# EAGLE design SpondeV2 (EAGLE 9.6.2)
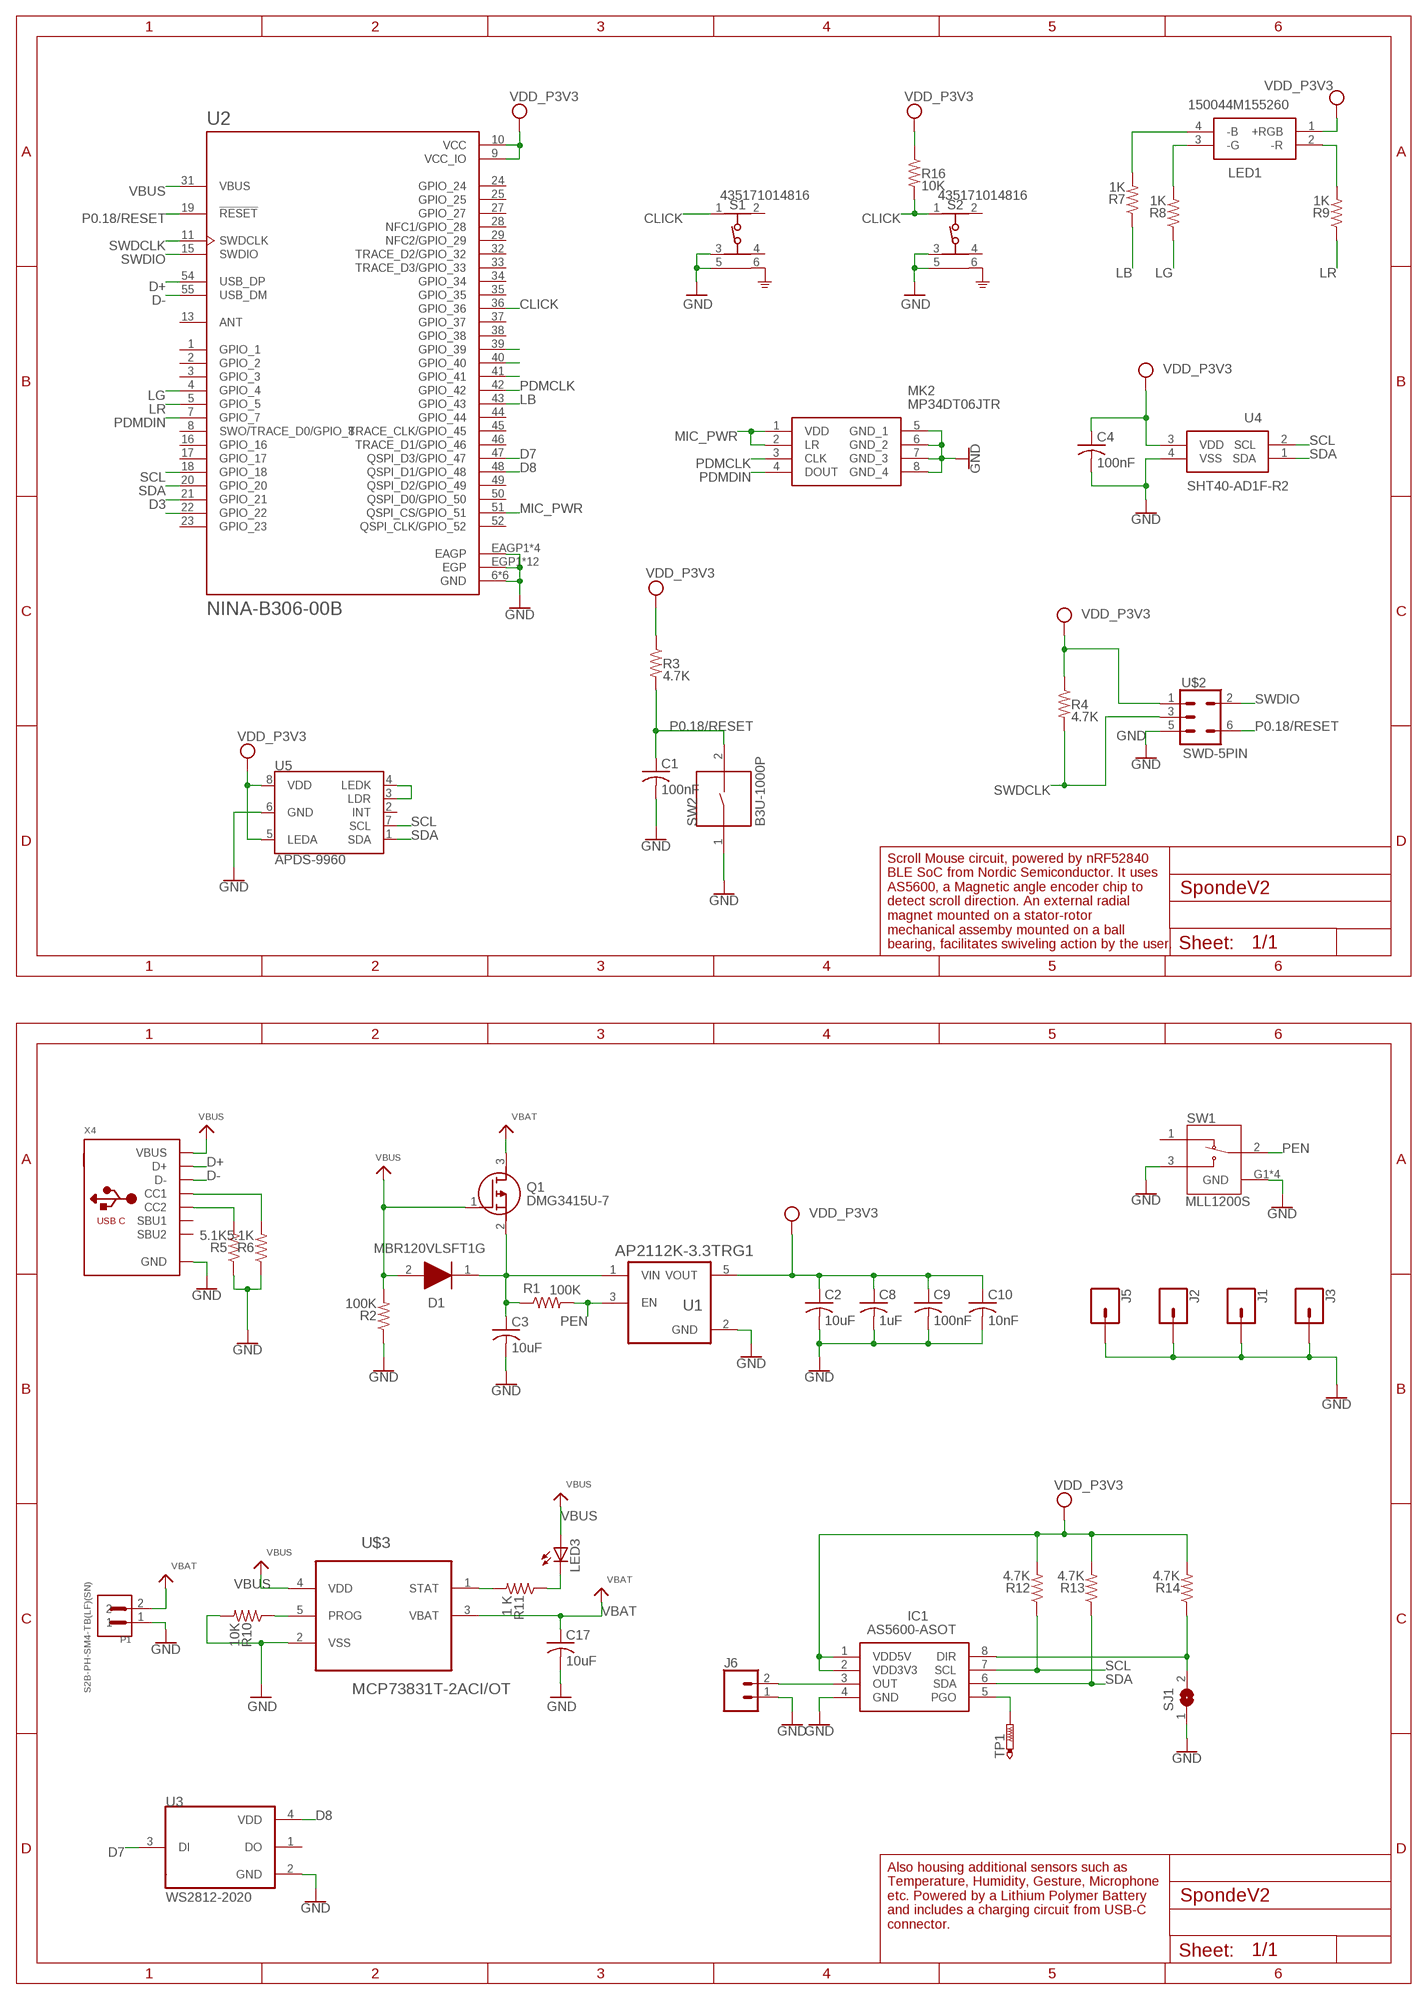
[diagram p0: schematic, sheet 1]

## Parts
C1  100nF  C-USC0402  [C0402]
C2  10uF  C-USC0402  [C0402]
C3  10uF  C-USC0402  [C0402]
C4  100nF  C-USC0402  [C0402]
C8  1uF  C-USC0402  [C0402]
C9  100nF  C-USC0402  [C0402]
C10  10nF  C-USC0402  [C0402]
C17  10uF  C-USC0402  [C0402]
D1  MBR120VLSFT1G  [SODFL3616X98N]
IC1  AS5600-ASOT  [SOIC127P600X175-8N]
J1  CONN_01PTH_2MM  [1X01_2MM]
J2  CONN_01PTH_2MM  [1X01_2MM]
J3  CONN_01PTH_2MM  [1X01_2MM]
J5  CONN_01PTH_2MM  [1X01_2MM]
J6  CONN_02LOCK_LONGPADS  [1X02_LOCK_LONGPADS]
LED1  150044M155260  [150044M155260]
LED3  LEDCHIPLED_0603  [CHIPLED_0603]
MK2  MP34DT06JTR  [MP34DT06JTR]
P1  S2B-PH-SM4-TB(LF)(SN)  [JST_S2B-PH-SM4-TB(LF)(SN)]
Q1  DMG3415U-7  [SOT96P240X100-3N]
R1  100K  R-US_R0402  [R0402]
R2  100K  R-US_R0402  [R0402]
R3  4.7K  R-US_R0402  [R0402]
R4  4.7K  R-US_R0402  [R0402]
R5  5.1K  R-US_R0402  [R0402]
R6  5.1K  R-US_R0402  [R0402]
R7  1K  R-US_R0402  [R0402]
R8  1K  R-US_R0402  [R0402]
R9  1K  R-US_R0402  [R0402]
R10  10K  R-US_R0402  [R0402]
R11  1 K  R-US_R0402  [R0402]
R12  4.7K  R-US_R0402  [R0402]
R13  4.7K  R-US_R0402  [R0402]
R14  4.7K  R-US_R0402  [R0402]
R16  10K  R-US_R0402  [R0402]
S1  435171014816  [435171014816]
S2  435171014816  [435171014816]
SJ1  SJ  [SJ]
SW1  MLL1200S  [SW_MLL1200S]
SW2  B3U-1000P  [SW_B3U-1000P]
TP1  PTR1B2,54  [B2,54]
U1  AP2112K-3.3TRG1  [SOT95P285X140-5N]
U2  NINA-B306-00B  [XCVR_NINA-B306-00B]
U3  WS2812-2020  [LED_WS2812-2020]
U4  SHT40-AD1F-R2  [SHT40AD1FR2]
U5  APDS-9960  [APDS-9960]
U$2  SWD-5PIN  [PAD_05_03X2_TP_NO4]
U$3  MCP73831T-2ACI/OT  [SOT95P280X145-5N]
X4  MICROBUILDER_USB_C  [MICROBUILDER_USB_C_CUSB31-CFM2AX-01-X]

## Nets
CLICK: R16.2 S1.1 S2.1 U2.36(GPIO_36)
D3: U2.21(GPIO_21)
D7: U2.47(QSPI_D3/GPIO_47) U3.3(DI)
D8: U2.48(QSPI_D1/GPIO_48) U3.4(VDD)
D+: U2.54(USB_DP) X4.A6(D+) X4.B6(D+)
D-: U2.55(USB_DM) X4.A7(D-) X4.B7(D-)
GND: C1.2 C2.2 C3.2 C4.2 C8.2 C9.2 C10.2 C17.2 IC1.4(GND) J1.1 J2.1 J3.1 J5.1 J6.1 MK2.5(GND_1) MK2.6(GND_2) MK2.7(GND_3) MK2.8(GND_4) P1.1 R2.1 R5.1 R6.1 R10.2 S1.3 S1.5 S2.3 S2.5 SJ1.1 SW1.3 SW1.G1(GND) SW1.G2(GND) SW1.G3(GND) SW1.G4(GND) SW2.1 U1.2(GND) U2.6(GND) U2.12(GND) U2.14(GND) U2.26(GND) U2.30(GND) U2.53(GND) U2.EAGP1(EAGP) U2.EAGP2(EAGP) U2.EAGP3(EAGP) U2.EAGP4(EAGP) U2.EGP1(EGP) U2.EGP2(EGP) U2.EGP3(EGP) U2.EGP4(EGP) U2.EGP5(EGP) U2.EGP6(EGP) U2.EGP7(EGP) U2.EGP8(EGP) U2.EGP9(EGP) U2.EGP10(EGP) U2.EGP11(EGP) U2.EGP12(EGP) U3.2(GND) U4.4(VSS) U5.6(GND) U$2.5 U$3.2(VSS) X4.A1B12(GND) X4.B1A12(GND)
LB: R7.1 U2.43(GPIO_43)
LG: R8.1 U2.4(GPIO_4)
LR: R9.1 U2.5(GPIO_5)
MIC_PWR: MK2.1(VDD) MK2.2(LR) U2.51(QSPI_CS/GPIO_51)
N$1: U2.22(GPIO_22)
N$2: IC1.5(PGO) TP1.TP
N$3: U2.41(GPIO_41)
N$4: R11.2 U$3.1(STAT)
N$5: U2.40(GPIO_40)
N$6: U2.39(GPIO_39)
N$7: R5.2 X4.B5(CC2)
N$9: R6.2 X4.A5(CC1)
N$10: C3.1 D1.1(K) Q1.2(S) R1.1 U1.1(VIN)
N$12: U5.3(LDR) U5.4(LEDK)
N$13: IC1.8(DIR) R14.1 SJ1.2
N$15: IC1.3(OUT) J6.2
N$17: LED1.4(-B) R7.2
N$18: LED1.3(-G) R8.2
N$26: R10.1 U$3.5(PROG)
N$30: LED3.C R11.1
N$32: LED1.2(-R) R9.2
P0.18/RESET: C1.1 R3.2 SW2.2 U2.19(!RESET) U$2.6
PDMCLK: MK2.3(CLK) U2.42(GPIO_42)
PDMDIN: MK2.4(DOUT) U2.7(GPIO_7)
PEN: R1.2 SW1.2 U1.3(EN)
SCL: IC1.7(SCL) R12.1 U2.18(GPIO_18) U4.2(SCL) U5.7(SCL)
SDA: IC1.6(SDA) R13.1 U2.20(GPIO_20) U4.1(SDA) U5.1(SDA)
SWDCLK: R4.2 U2.11(SWDCLK) U$2.3
SWDIO: U2.15(SWDIO) U$2.2
VBAT: C17.1 P1.2 Q1.3(D) U$3.3(VBAT)
VBUS: D1.2(A) LED3.A Q1.1(G) R2.2 U2.31(VBUS) U$3.4(VDD) X4.A4B9(VBUS) X4.B4A9(VBUS)
VCC: C2.1 C4.1 C8.1 C9.1 C10.1 IC1.1(VDD5V) IC1.2(VDD3V3) LED1.1(+RGB) R3.1 R4.1 R12.2 R13.2 R14.2 R16.1 U1.5(VOUT) U2.9(VCC_IO) U2.10(VCC) U4.3(VDD) U5.5(LEDA) U5.8(VDD) U$2.1 ; supply symbol labelled VDD_P3V3
Unconnected: S1.2 S1.4 S1.6 S2.2 S2.4 S2.6 SW1.1 U2.1(GPIO_1) U2.2(GPIO_2) U2.3(GPIO_3) U2.8(SWO/TRACE_D0/GPIO_8) U2.13(ANT) U2.16(GPIO_16) U2.17(GPIO_17) U2.23(GPIO_23) U2.24(GPIO_24) U2.25(GPIO_25) U2.27(GPIO_27) U2.28(NFC1/GPIO_28) U2.29(NFC2/GPIO_29) U2.32(TRACE_D2/GPIO_32) U2.33(TRACE_D3/GPIO_33) U2.34(GPIO_34) U2.35(GPIO_35) U2.37(GPIO_37) U2.38(GPIO_38) U2.44(GPIO_44) U2.45(TRACE_CLK/GPIO_45) U2.46(TRACE_D1/GPIO_46) U2.49(QSPI_D2/GPIO_49) U2.50(QSPI_D0/GPIO_50) U2.52(QSPI_CLK/GPIO_52) U3.1(DO) U5.2(INT) X4.A8(SBU1) X4.B8(SBU2)

## Notes on the sheet
- Scroll Mouse circuit, powered by nRF52840 
  BLE SoC from Nordic Semiconductor. It uses 
  AS5600, a Magnetic angle encoder chip to 
  detect scroll direction. An external radial
  magnet mounted on a stator-rotor 
  mechanical assemby mounted on a ball 
  bearing, facilitates swiveling action by the user.
- Also housing additional sensors such as 
  Temperature, Humidity, Gesture, Microphone 
  etc. Powered by a Lithium Polymer Battery
  and includes a charging circuit from USB-C
  connector.

## Library data of the parts
C1-C4 C8-C10 C17 = adafruit:C-US: CAPACITOR, American symbol
D1 = MBR120VLSFT1G:MBR120VLSFT1G: Diode Schottky 20V 1A SOD123FL ON Semi MBR120VLSFT1G, SMT Schottky Diode, 20V 1A, 2-Pin SOD-123FL Source: Datasheet <http://www.onsemi.com/pub/Collateral/MBR120VLSFT1-D.PDF>; DESCRIPTION: Diode Schottky 20V 1A SOD123FL ON Semi MBR120VLSFT1G, SMT Schottky Diode, 20V 1A, 2-Pin SOD-123FL; HEIGHT: 0.98mm; MANUFACTURER_NAME: ON Semiconductor; MANUFACTURER_PART_NUMBER: MBR120VLSFT1G; MOUSER_PART_NUMBER: 863-MBR120VLSFT1G; MOUSER_PRICE-STOCK: https://www.mouser.co.uk/ProductDetail/ON-Semiconductor/MBR120VLSFT1G?qs=3JMERSakebpX%252BkItPpFCkg%3D%3D
IC1 = AS5600-ASOT:AS5600-ASOT: Board Mount Hall Effect / Magnetic Sensors AS5600 Magnetic Sensor 12-Bit Source: Datasheet <https://datasheet.datasheetarchive.com/originals/distributors/DKDS-11/214624.pdf>; ARROW_PART_NUMBER: AS5600-ASOT; ARROW_PRICE-STOCK: https://www.arrow.com/en/products/as5600-asot/ams-osram?utm_currency=USD&region=nac; DESCRIPTION: Board Mount Hall Effect / Magnetic Sensors AS5600 Magnetic Sensor 12-Bit; HEIGHT: 1.75mm; MANUFACTURER_NAME: ams OSRAM; MANUFACTURER_PART_NUMBER: AS5600-ASOT; MOUSER_PART_NUMBER: 985-AS5600-ASOT; MOUSER_PRICE-STOCK: https://www.mouser.co.uk/ProductDetail/ams-OSRAM/AS5600-ASOT?qs=KTMMzrZdriGJpjhsnAEYBA%3D%3D
J1-J3 J5 = SparkFun-Connectors:CONN_01: Single connection point. Often used as Generic Header-pin footprint for 0.1 inch spaced/style header connections On any of the 0.1 inch spaced packages, you can populate with these: Break Away Headers - Straight <https://www.sparkfun.com/products/116> (PRT-00116) Break Away Male Headers - Right Angle <https://www.sparkfun.com/products/553> (PRT-00553) Female Headers <https://www.sparkfun.com/products/115> (PRT-00115) Break Away Headers - Machine Pin <https://www.sparkfun.com/products/117> (PRT-00117) Break Away Female Headers - Swiss Machine Pin <https://www.sparkfun.com/products/743> (PRT-00743) This device is also useful as a general connection point to wire up your design to another part of your project. Our various solder wires solder well into these plated through hole pads. Hook-Up Wire - Assortment (Stranded, 22 AWG) <https://www.sparkfun.com/products/11375> (PRT-11375) Hook-Up Wire - Assortment (Solid Core, 22 AWG) <https://www.sparkfun.com/products/11367> (PRT-11367) View the entire wire category on our website here <https://www.sparkfun.com/categories/141> Special notes: SMTSO-256-ET is a "flush mount" nut for a 4-40 screw. We mostly use this on specialty testbeds; it is a nice way to connect hardware to your PCB at an adjustable hieght. Also note, the SNAP packages are for using a snappable style connector. We sell a baggie of snaps and they are also used on two LilyPad designs: Snap Assortment - 30 pack (male and female) <https://www.sparkfun.com/products/11347> (DEV-11347) LilyPad Arduino SimpleSnap <https://www.sparkfun.com/products/10941> (DEV-10941) LilyPad SimpleSnap Protoboard <https://www.sparkfun.com/products/10940> (DEV-10940)
J6 = SparkFun-Connectors:CONN_02: Multi connection point. Often used as Generic Header-pin footprint for 0.1 inch spaced/style header connections On any of the 0.1 inch spaced packages, you can populate with these: Break Away Headers - Straight <https://www.sparkfun.com/products/116> (PRT-00116) Break Away Male Headers - Right Angle <https://www.sparkfun.com/products/553> (PRT-00553) Female Headers <https://www.sparkfun.com/products/115> (PRT-00115) Break Away Headers - Machine Pin <https://www.sparkfun.com/products/117> (PRT-00117) Break Away Female Headers - Swiss Machine Pin <https://www.sparkfun.com/products/743> (PRT-00743) For SCREWTERMINALS and SPRING TERMINALS visit here: Screw Terimnals on SparkFun.com <https://www.sparkfun.com/search/results?term=Screw+Terminals> (5mm/3.5mm/2.54mm spacing) This device is also useful as a general connection point to wire up your design to another part of your project. Our various solder wires solder well into these plated through hole pads. Hook-Up Wire - Assortment (Stranded, 22 AWG) <https://www.sparkfun.com/products/11375> (PRT-11375) Hook-Up Wire - Assortment (Solid Core, 22 AWG) <https://www.sparkfun.com/products/11367> (PRT-11367) View the entire wire category on our website here <https://www.sparkfun.com/categories/141> Special notes: Molex polarized connector foot print use with: PRT-08233 with associated crimp pins and housings. 2.54_SCREWTERM for use with PRT-10571. 3.5mm Screw Terminal footprints for PRT-08084 5mm Screw Terminal footprints for use with PRT-08432
LED1 = Wurth-RGB-150044M155260:150044M155260: 2.4 V, 3.1 V, 3.3 V RGB LED 1010 (0404) SMD, Wurth Elektronik WL-SFCC 150044M155260 Source: Datasheet <https://www.we-online.com/catalog/datasheet/150044M155260.pdf>; DESCRIPTION: 2.4 V, 3.1 V, 3.3 V RGB LED 1010 (0404) SMD, Wurth Elektronik WL-SFCC 150044M155260; HEIGHT: 0.75mm; MANUFACTURER_NAME: Wurth Elektronik; MANUFACTURER_PART_NUMBER: 150044M155260; MOUSER_PART_NUMBER: 710-150044M155260; MOUSER_PRICE-STOCK: https://www.mouser.co.uk/ProductDetail/Wurth-Elektronik/150044M155260?qs=u16ybLDytRba39Og9E2ywA%3D%3D
LED3 = adafruit:LED: LED OSRAM: - CHIPLED LG R971, LG N971, LY N971, LG Q971, LY Q971, LO R971, LY R971 LH N974, LH R974 LS Q976, LO Q976, LY Q976 LO Q996 - Hyper CHIPLED LW Q18S LB Q993, LB Q99A, LB R99A - SideLED LS A670, LO A670, LY A670, LG A670, LP A670 LB A673, LV A673, LT A673, LW A673 LH A674 LY A675 LS A676, LA A676, LO A676, LY A676, LW A676 LS A679, LY A679, LG A679 - Hyper Micro SIDELED® LS Y876, LA Y876, LO Y876, LY Y876 LT Y87S - SmartLED LW L88C, LW L88S LB L89C, LB L89S, LG L890 LS L89K, LO L89K, LY L89K LS L896, LA L896, LO L896, LY L896 - TOPLED LS T670, LO T670, LY T670, LG T670, LP T670 LSG T670, LSP T670, LSY T670, LOP T670, LYG T670 LG T671, LOG T671, LSG T671 LB T673, LV T673, LT T673, LW T673 LH T674 LS T676, LA T676, LO T676, LY T676, LB T676, LH T676, LSB T676, LW T676 LB T67C, LV T67C, LT T67C, LS T67K, LO T67K, LY T67K, LW E67C LS E67B, LA E67B, LO E67B, LY E67B, LB E67C, LV E67C, LT E67C LW T67C LS T679, LY T679, LG T679 LS T770, LO T770, LY T770, LG T770, LP T770 LB T773, LV T773, LT T773, LW T773 LH T774 LS E675, LA E675, LY E675, LS T675 LS T776, LA T776, LO T776, LY T776, LB T776 LHGB T686 LT T68C, LB T68C - Hyper Mini TOPLED® LB M676 - Mini TOPLED Santana® LG M470 LS M47K, LO M47K, LY M47K Source: http://www.osram.convergy.de/
MK2 = MP34DT06JTR:MP34DT06JTR: 100 Hz ~ 10 kHz Digital, PDM Microphone MEMS (Silicon) Omnidirectional (-26dB +/-3dB @ 94dB SPL) Solder Pads Source: Datasheet <https://www.st.com/resource/en/datasheet/mp34dt06j.pdf>; ARROW_PART_NUMBER: MP34DT06JTR; ARROW_PRICE-STOCK: https://www.arrow.com/en/products/mp34dt06jtr/stmicroelectronics?region=nac; DESCRIPTION: 100 Hz ~ 10 kHz Digital, PDM Microphone MEMS (Silicon) Omnidirectional (-26dB +/-3dB @ 94dB SPL) Solder Pads; HEIGHT: 1.1mm; MANUFACTURER_NAME: STMicroelectronics; MANUFACTURER_PART_NUMBER: MP34DT06JTR; MOUSER_PART_NUMBER: 511-MP34DT06JTR; MOUSER_PRICE-STOCK: https://www.mouser.co.uk/ProductDetail/STMicroelectronics/MP34DT06JTR?qs=%252BEew9%252B0nqrDi3H2kv8Y1Xg%3D%3D
P1 = S2B-PH-SM4-TB_LF__SN_:S2B-PH-SM4-TB(LF)(SN): CONN HEADER PH SIDE 2POS 2MM SMD; AVAILABILITY: Unavailable; DESCRIPTION: Connector Header Surface Mount, Right Angle 2 position 0.079 _2.00mm_; MF: JST Sales; MP: S2B-PH-SM4-TB _LF__SN_; PACKAGE: None; PRICE: None
Q1 = DMG3415U-7:DMG3415U-7: P-CHANNEL ENHANCEMENT MODE MOSFET Source: Datasheet <https://datasheet.lcsc.com/szlcsc/Diodes-Incorporated-DMG3415U-7_C96616.pdf>; DESCRIPTION: P-CHANNEL ENHANCEMENT MODE MOSFET; HEIGHT: 1mm; LCSC_PART_NUMBER: C96616; LCSC_PRICE-STOCK: https://lcsc.com/product-detail/MOSFET_Diodes-Incorporated_DMG3415U-7_Diodes-Incorporated-DMG3415U-7_C96616.html; MANUFACTURER_NAME: Diodes Inc.; MANUFACTURER_PART_NUMBER: DMG3415U-7
R1-R14 R16 = adafruit:R-US_: RESISTOR, American symbol
S1 S2 = 435171014816:435171014816: Check availability <https://pricing.snapeda.com/parts/435171014816/W%C3%BCrth%20Elektronik/view-part?ref=eda>; AVAILABILITY: In Stock; CHECK_PRICES: https://www.snapeda.com/parts/435171014816/W%25C3%25BCrth+Elektronik+Midcom/view-part/?ref=eda; DESCRIPTION: Tactile Switch SPST-NO Top Actuated Surface Mount; MF: Würth Elektronik; MP: 435171014816; PACKAGE: None; PRICE: None; SNAPEDA_LINK: https://www.snapeda.com/parts/435171014816/W%25C3%25BCrth+Elektronik+Midcom/view-part/?ref=snap
SJ1 = jumper:SJ: SMD solder JUMPER
SW1 = MLL1200S:MLL1200S: Switch Slide SPDT Side Slide 0.3A 4VDC Gull Wing SMD Box Check prices <https://pricing.snapeda.com/parts/MLL1200S/TE%20Connectivity/view-part?ref=eda>; AVAILABILITY: In Stock; COMMENT: 1437575-1; DESCRIPTION: Slide Switch SPDT Surface Mount, Right Angle; MF: TE Connectivity; MP: MLL1200S; PACKAGE: None; PRICE: None; PURCHASE-URL: https://pricing.snapeda.com/search/part/MLL1200S/?ref=eda
SW2 = B3U-1000P:B3U-1000P: Switch Tactile N.O. SPST Round Button Gull Wing 0.05A 12VDC 1.5N SMD Embossed T/R; AVAILABILITY: Unavailable; DESCRIPTION: Switch Tactile N.O. SPST Round Button Gull Wing 0.05A 12VDC 1.5N SMD Embossed T/R; MF: Omron; MP: B3U-1000P; PACKAGE: None; PRICE: None
TP1 = testpad:PTR1: TEST PIN
U1 = AP2112K-3.3TRG1:AP2112K-3.3TRG1: AP2112 Series 0.6 A 3.3 V Fixed Output SMT LDO Linear Regulator - SOT23-5; AVAILABILITY: Unavailable; DESCRIPTION: AP2112 Series 0.6 A 3.3 V Fixed Output SMT LDO Linear Regulator - SOT23-5; MF: Diodes Inc.; MP: AP2112K-3.3TRG1; PACKAGE: SOT-753 Diodes Inc.; PRICE: None
U2 = NINA-B306-00B:NINA-B306-00B: With internal PCB antenna, 10.0 x 15.0 x 2.2 mm, use with open CPU Check availability <https://pricing.snapeda.com/parts/NINA-B306-00B/U-Blox/view-part?ref=eda>; AVAILABILITY: In Stock; CHECK_PRICES: https://www.snapeda.com/parts/NINA-B306-00B/u-blox/view-part/?ref=eda; DESCRIPTION: Bluetooth Bluetooth v5.0 Transceiver Module 2.4GHz Integrated, Trace Surface Mount; MF: U-Blox; MP: NINA-B306-00B; PACKAGE: SMD-55 U-Blox; PRICE: None; PURCHASE-URL: https://www.snapeda.com/api/url_track_click_mouser/?unipart_id=4800389&manufacturer=U-Blox&part_name=NINA-B306-00B&search_term=nina-b306-00b; SNAPEDA_LINK: https://www.snapeda.com/parts/NINA-B306-00B/u-blox/view-part/?ref=snap
U3 = WS2812-2020:WS2812-2020: Intelligent control LED integrated light source Check availability <https://pricing.snapeda.com/parts/WS2812-2020/Worldsemi/view-part?ref=eda>; AVAILABILITY: Not in stock; DESCRIPTION: Intelligent control LED light source, SMD-4; MF: Worldsemi; MP: WS2812-2020; PACKAGE: Package; PRICE: None
U4 = SHT40-AD1F-R2:SHT40-AD1F-R2: Board Mount Humidity Sensors Digital Humidity and Temperature Sensor incl Filter Membrane Source: Datasheet <https://sensirion.com/media/documents/33FD6951/63E1087C/Datasheet_SHT4x_1.pdf>; ARROW_PART_NUMBER: SHT40-AD1F-R2; ARROW_PRICE-STOCK: https://www.arrow.com/en/products/sht40-ad1f-r2/sensirion-ag?region=nac; DESCRIPTION: Board Mount Humidity Sensors Digital Humidity and Temperature Sensor incl Filter Membrane; HEIGHT: 0.59mm; MANUFACTURER_NAME: Sensirion; MANUFACTURER_PART_NUMBER: SHT40-AD1F-R2; MOUSER_PART_NUMBER: 403-SHT40-AD1F-R2; MOUSER_PRICE-STOCK: https://www.mouser.co.uk/ProductDetail/Sensirion/SHT40-AD1F-R2?qs=rQFj71Wb1eVPr6MxV5k7AQ%3D%3D
U5 = APDS-9960:APDS-9960: Avago APDS-9960 Digital Proximity, Ambient Light, RGB, and Gesture Sensor. The APDS-9960 offers ambient light and color measuring, proximity detection, and touchless gesture sensing. It features UV and IR blocking filters, four separate diodes sensitive to different directions, and an I2C compatible interface. Datasheet <https://cdn.sparkfun.com/datasheets/Sensors/Proximity/apds9960.pdf> SparkFun Products SparkFun RGB and Gesture Sensor - APDS-9960 <https://www.sparkfun.com/products/12787> (SEN-12787) Check availability <https://pricing.snapeda.com/parts/APDS-9960/Broadcom%20Limited/view-part?ref=eda>; AVAILABILITY: In Stock; DESCRIPTION: Optical Sensor Ambient 560nm I²C 8-SMD Module; MF: Broadcom Limited; MP: APDS-9960; PACKAGE: SMD-8 Broadcom Limited; PRICE: None; PURCHASE-URL: https://pricing.snapeda.com/search/part/APDS-9960/?ref=eda
U$2 = SparkFun-Connectors:SWD-5PIN: 5-pin SWD connector Test-point based header for SWD. Pin 1 - PWR Pin 2 - SWDIO Pin 3 - SWCLK Pin 4 - NC Pin 5 - GND Pin 6 - RESET
U$3 = MCP73831T-2ACI_OT:MCP73831T-2ACI/OT: Charge Management Controller; AVAILABILITY: Unavailable; DESCRIPTION: MCP73831 Series Single-Cell Li-Ion/Li-Polymer Battery Charge Controller SOT-23-5; MF: Microchip; MP: MCP73831T-2ACI/OT; PACKAGE: SOT-23 Microchip; PRICE: None
X4 = Adafruit Feather STM32F405 Express:MICROBUILDER_USB_C: USB Type-C USB 2.0 Connector

## Board
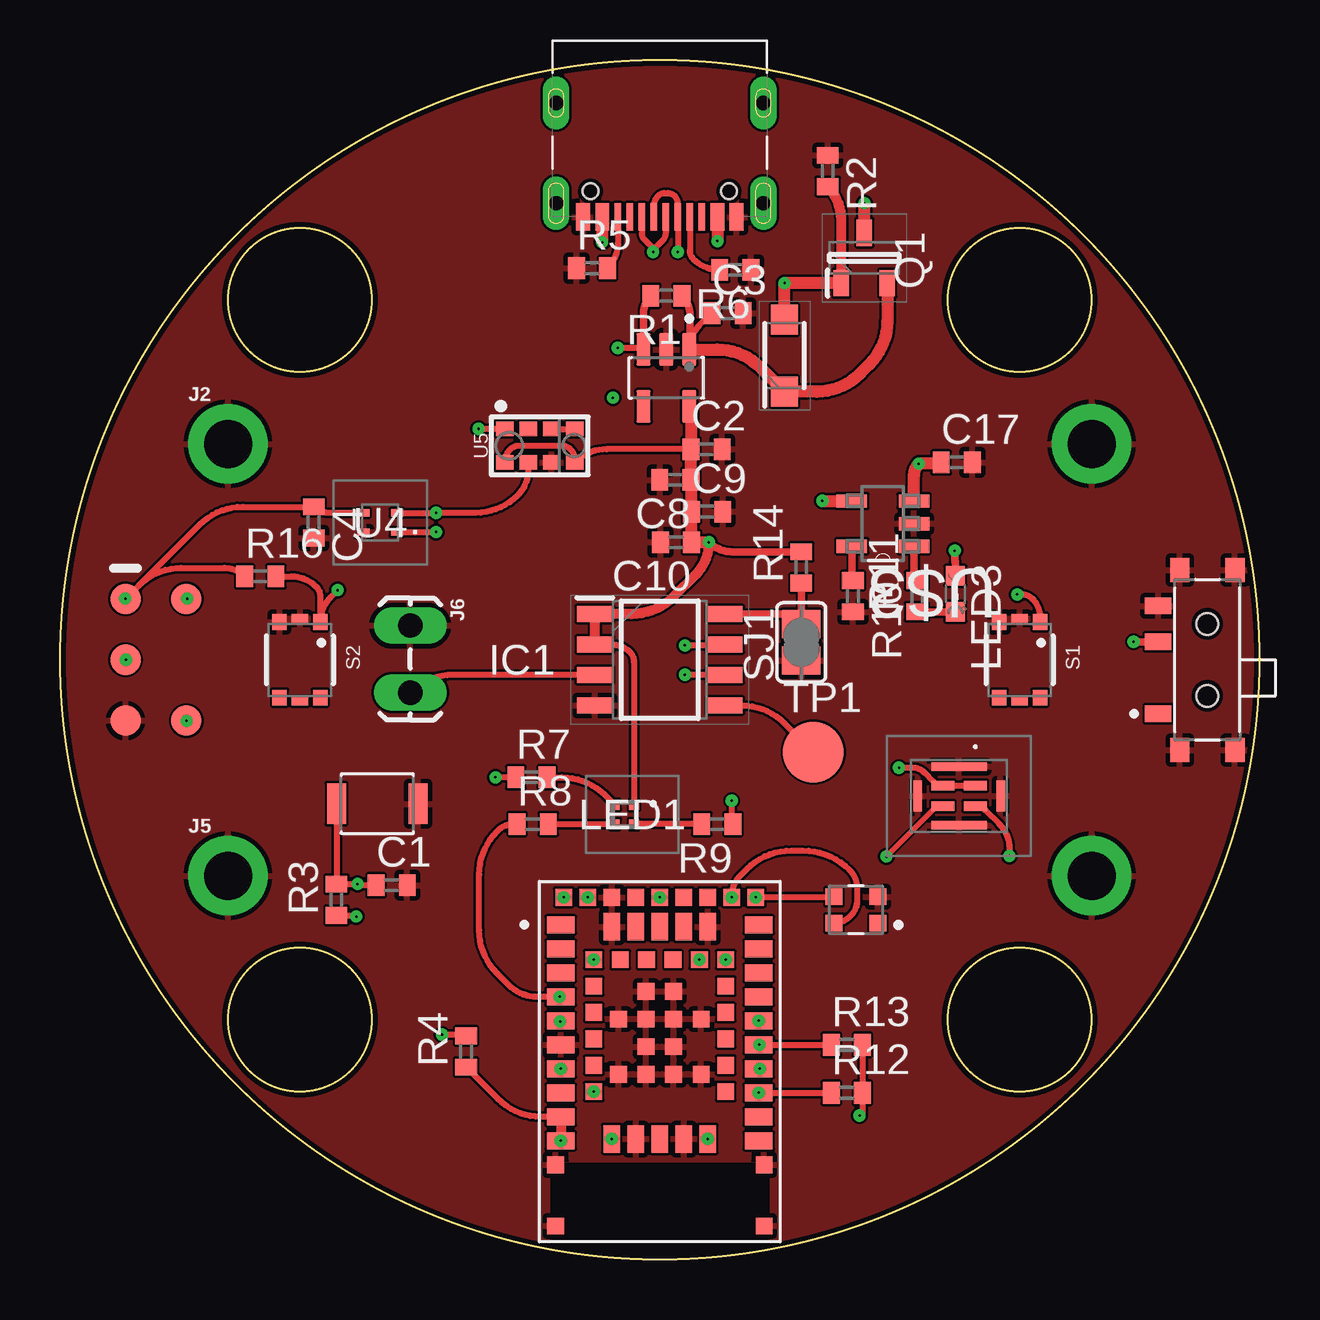
[diagram p1: board, top side]
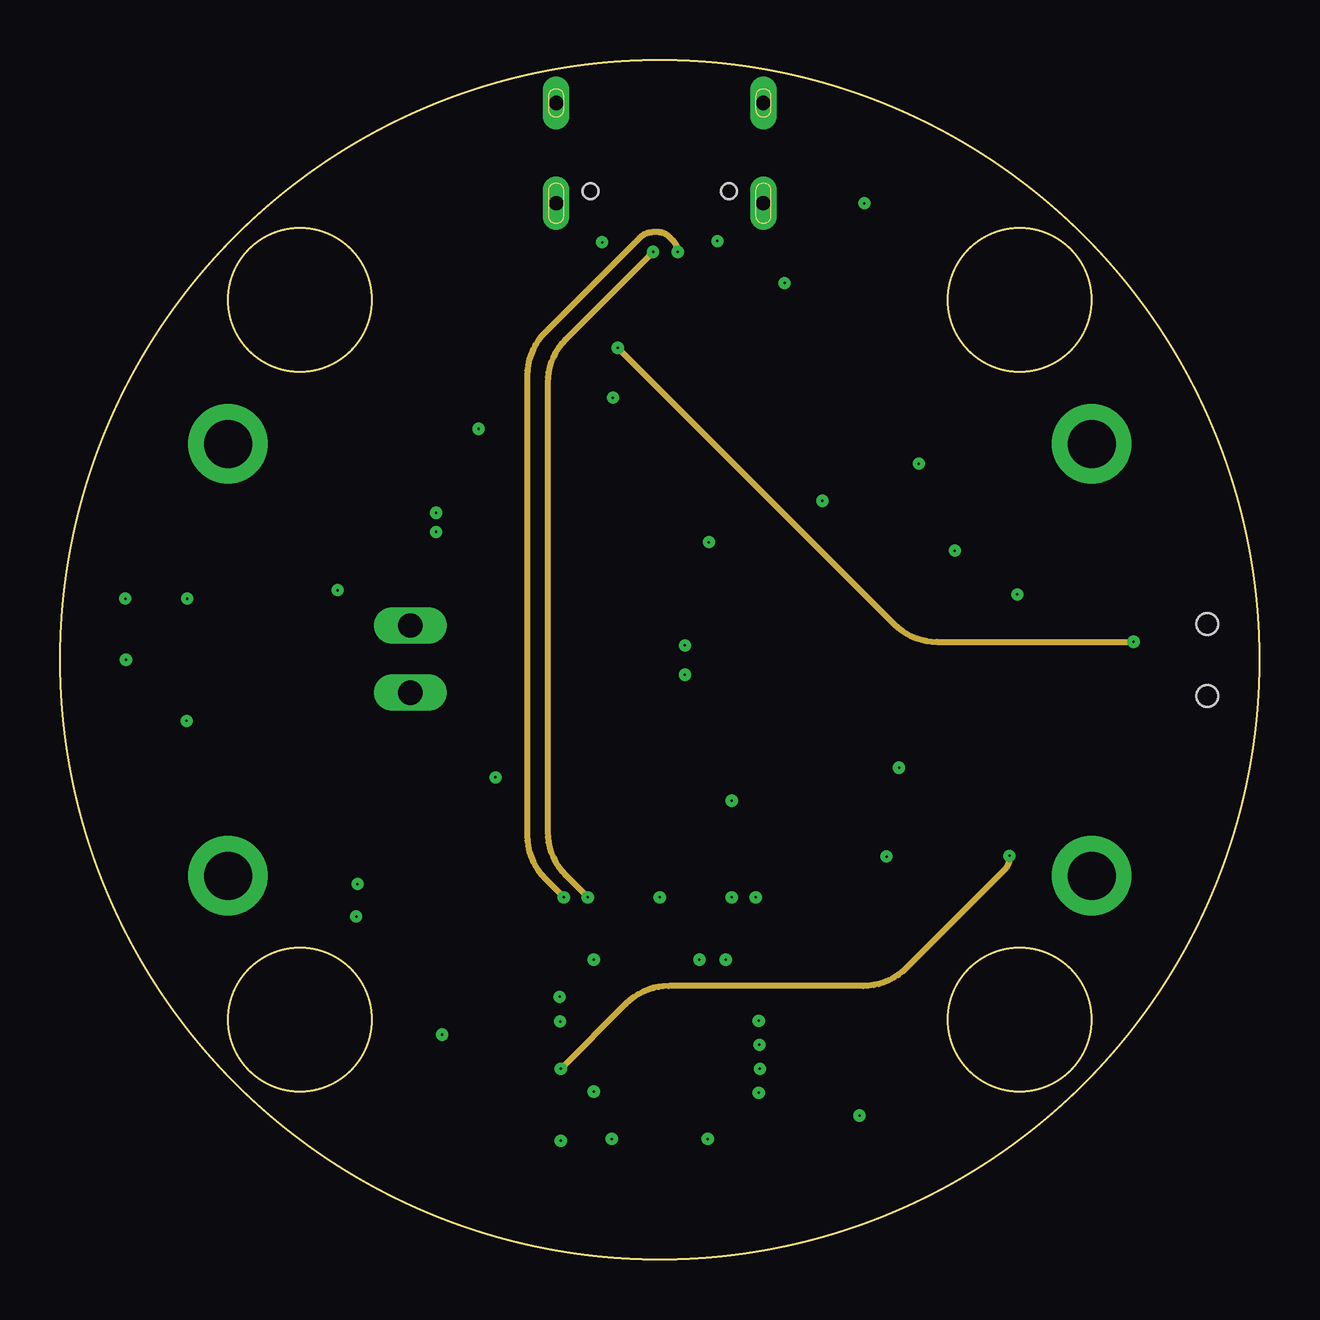
[diagram p2: board, inner layer Route2]
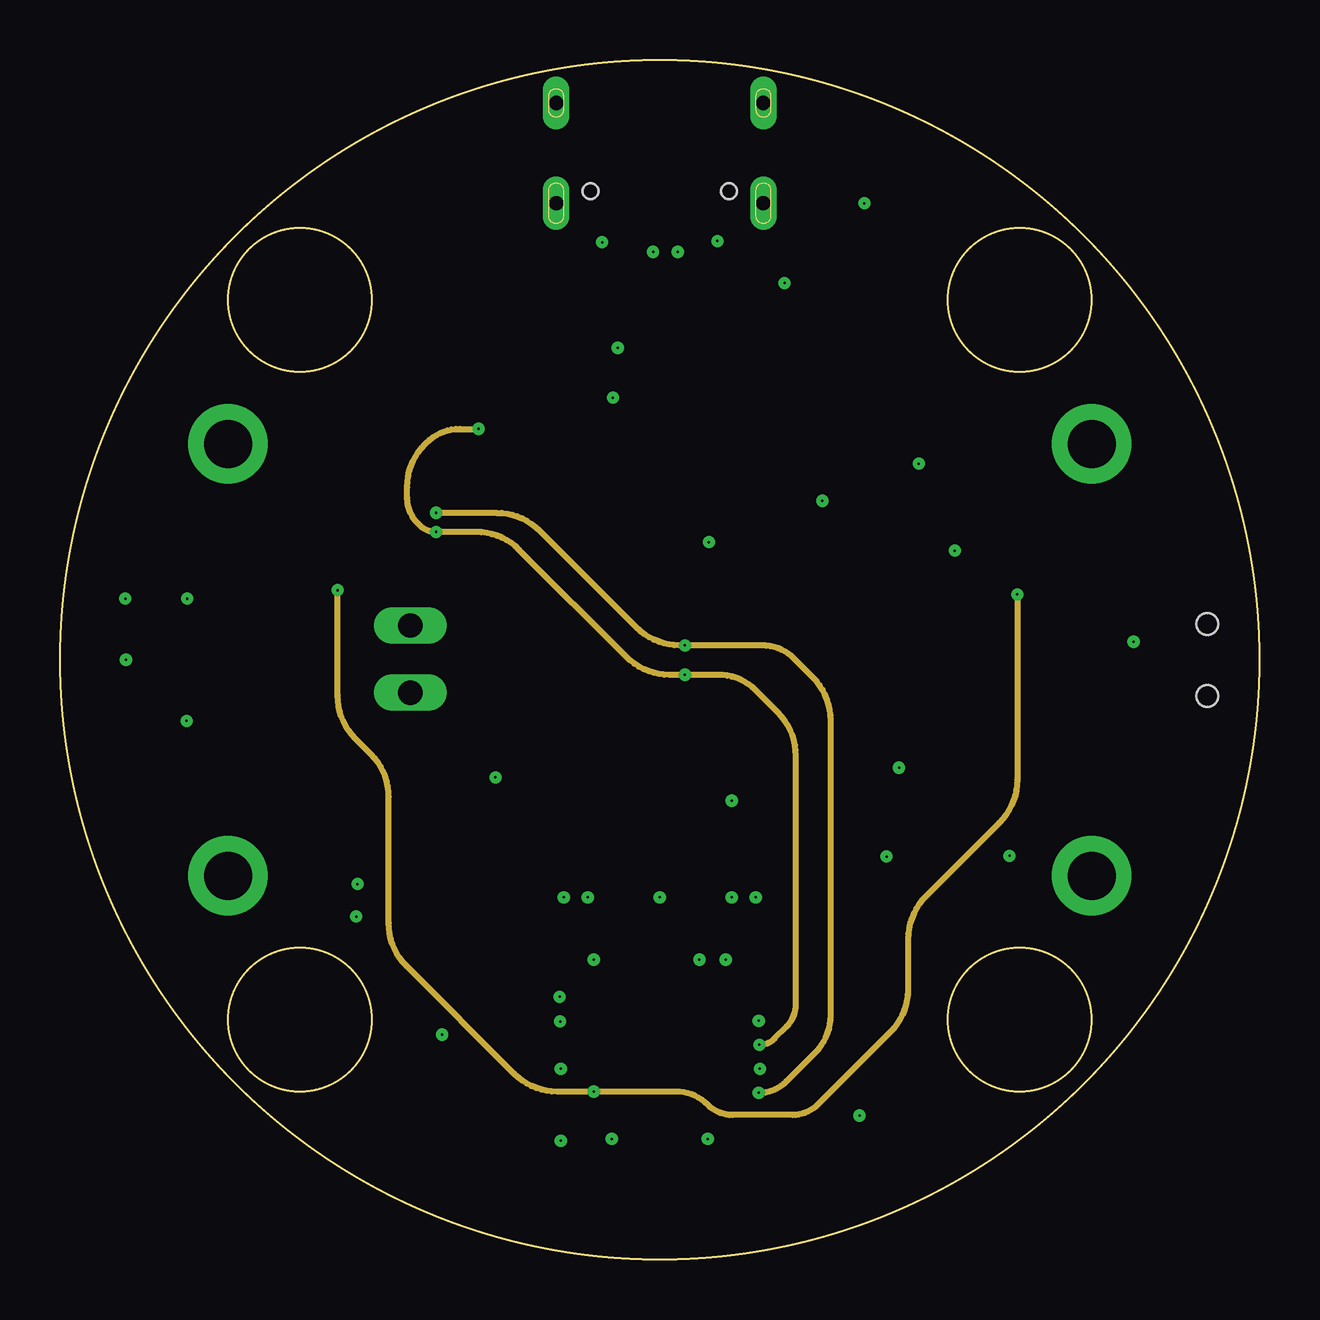
[diagram p3: board, inner layer Route3]
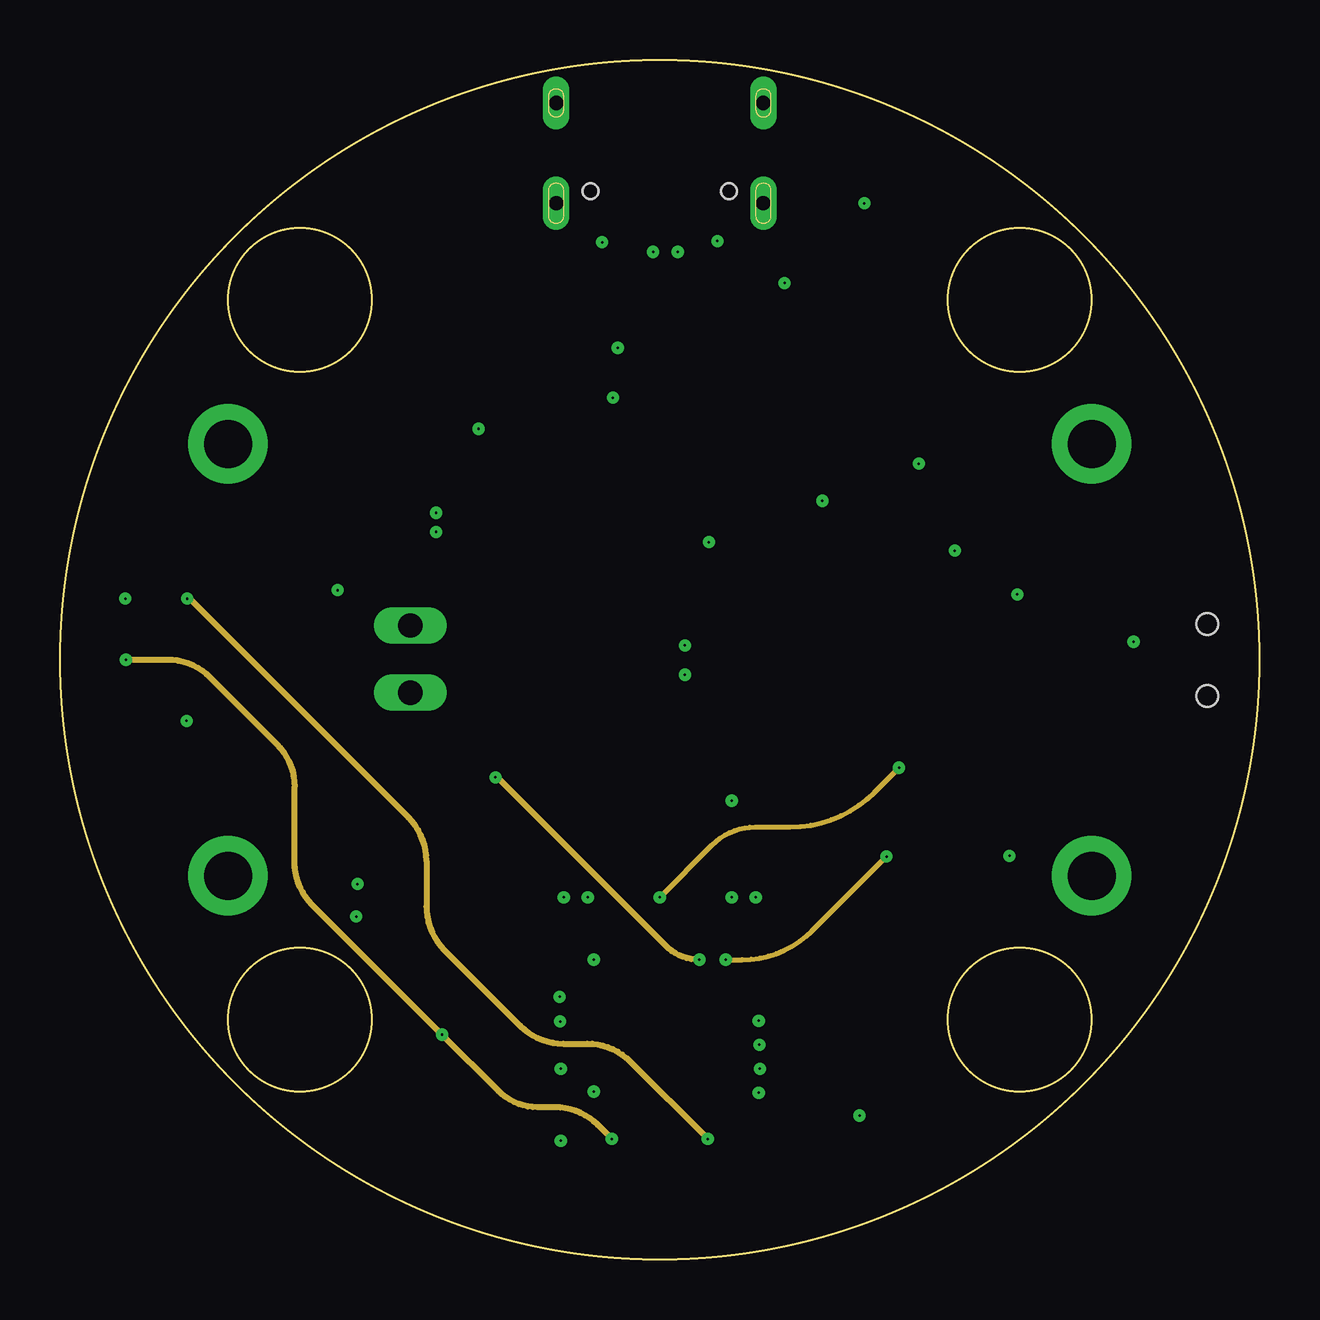
[diagram p4: board, inner layer Route14]
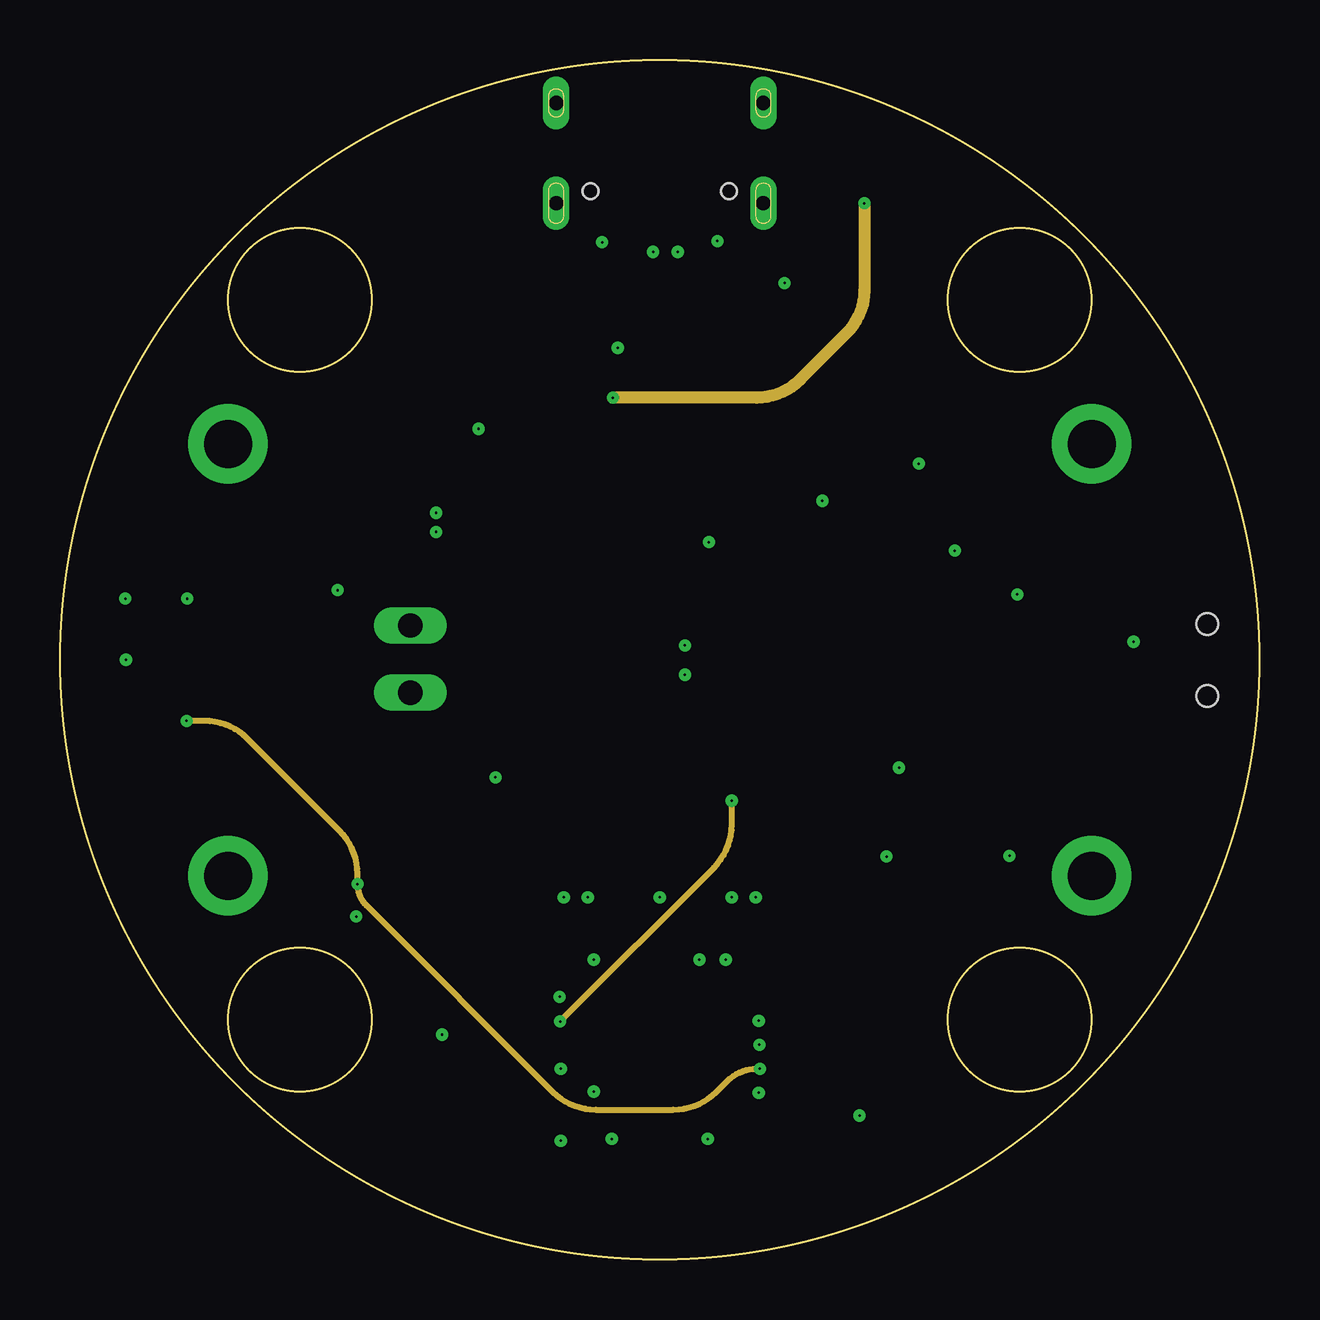
[diagram p5: board, inner layer Route15]
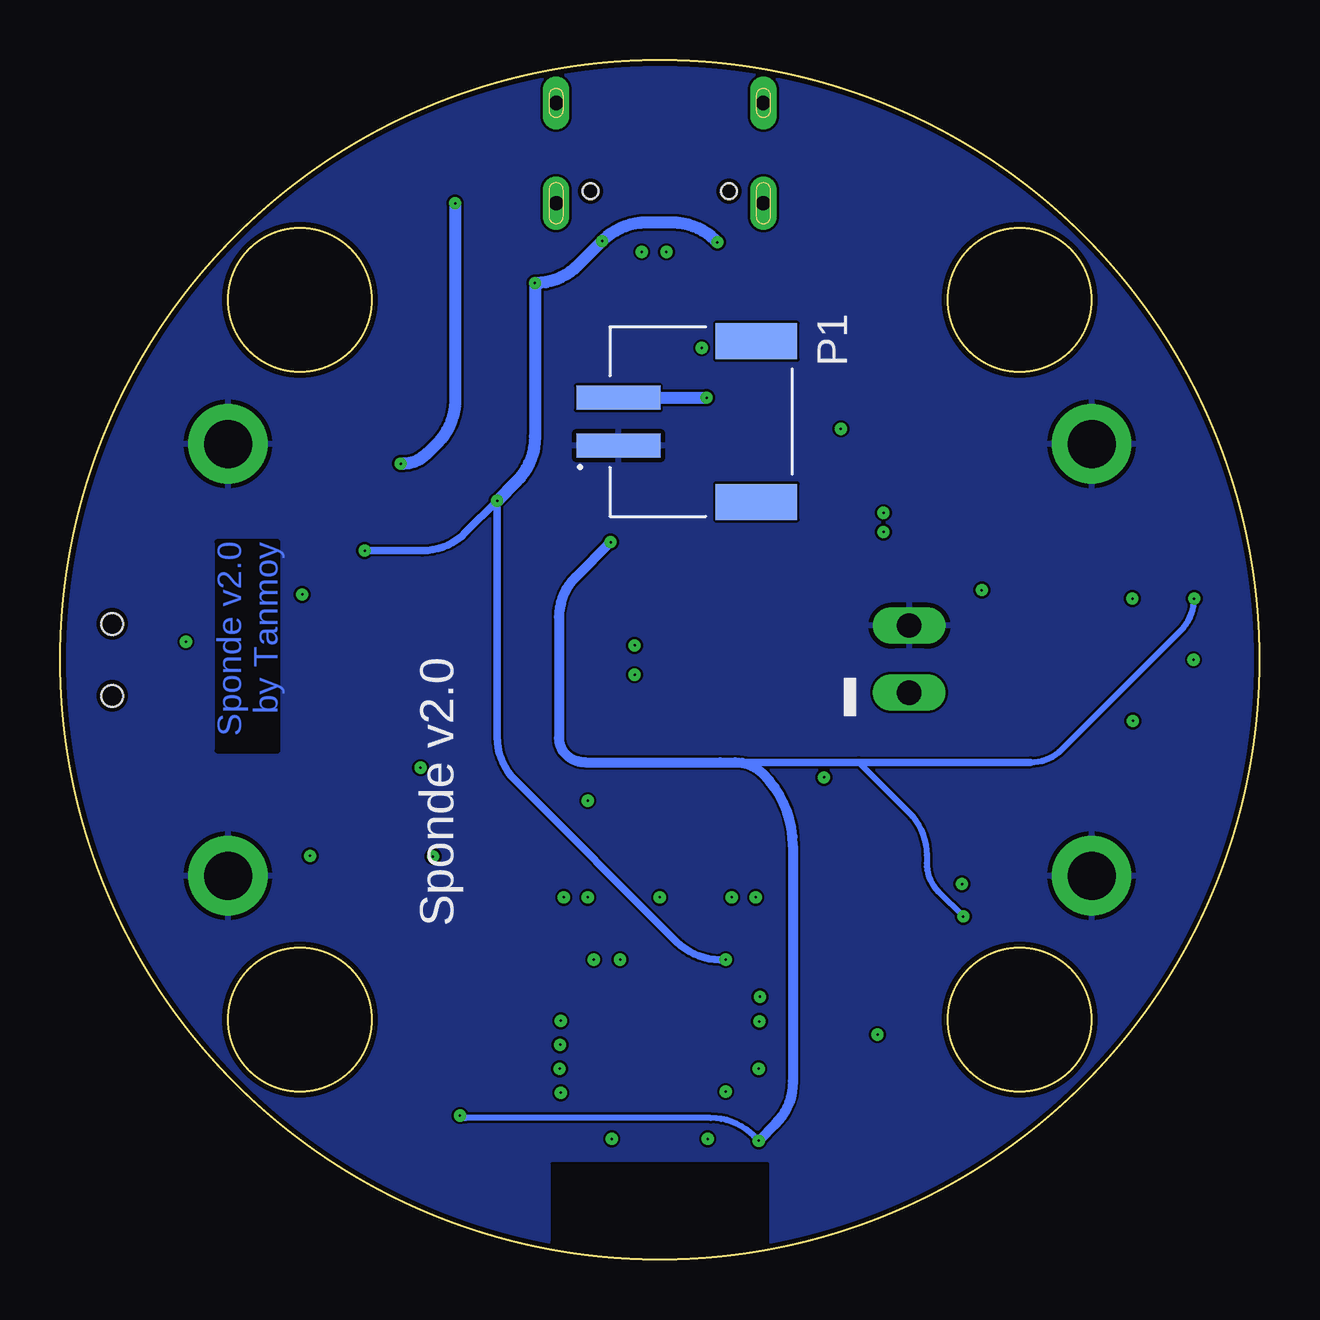
[diagram p6: board, bottom side, seen from below]

Size 50 x 50 mm. Coordinates in mm from the lower left corner, seen from the top.
Outline: circle at 40,40 radius 3
Outline: circle at 40,10 radius 3
Outline: circle at 10,10 radius 3
Outline: circle at 10,40 radius 3
Outline: circle at 25,25 radius 25
Copper layers (1+2*3+14*15+16): Top 0.035mm / dielectric 0.2mm / Route2 0.035mm / dielectric 1.1mm / Route3 0.035mm / dielectric 0.2mm / Route14 0.035mm / dielectric 0.15mm / Route15 0.035mm / dielectric 0.2mm / Bottom 0.035mm
Design rules "Nordic *": minimum track width 0.1mm, minimum drill 0.15mm, track to track 0.1mm, track to pad 0.1mm, pad to pad 0.1mm, via to via 0.1mm, smd to smd 0.1mm, copper to edge 0.2mm, drill to drill 0.2mm, minimum pad ring 10mil, minimum via ring 8mil, stop-mask expansion 4mil, vias tented up to drill 0mil, thermal gap 0.2mm
tRestrict: area 20.5,0.8 to 29.5,4
bRestrict: area 20.5,0.8 to 29.5,4

### Footprints (pad centres in the part's own frame; a part is rotated, then mirrored left to right if it is on the bottom)
C0402 = smd 0.7 x 0.9: 1 -0.65,0; 2 0.65,0
SODFL3616X98N = smd 1.24 x 1.12: 1 -1.5,0; 2 1.5,0
SOIC127P600X175-8N = smd 1.5 x 0.65: 1 -2.7,1.905; 2 -2.7,0.635; 3 -2.7,-0.635; 4 -2.7,-1.905; 5 2.7,-1.905; 6 2.7,-0.635; 7 2.7,0.635; 8 2.7,1.905
1X01_2MM = drill 2 pad 3.302: 1 0,0
1X02_LOCK_LONGPADS = drill 1.016 long: 1 -0.127,0; 2 2.667,0
150044M155260 = smd 0.4 x 0.4: 1 -0.4,-0.4; 2 -0.4,0.4; 3 0.4,0.4; 4 0.4,-0.4
CHIPLED_0603 = smd 0.8 x 0.8: A 0,-0.75; C 0,0.75
MP34DT06JTR = smd 0.4 x 0.95: 1 0.425,-0.675; 2 0.425,0.675; 3 -0.425,0.675; 4 -0.425,-0.675 | smd 1.3 x 0.35: 5 0,-1.725; 7 0,1.725 | smd 0.35 x 2.3: 6 -1.225,0; 8 1.225,0
JST_S2B-PH-SM4-TB(LF)(SN) = smd 1 x 3.5: 1 1,0; 2 -1,0 | smd 1.5 x 3.4: P1 3.35,5.75; P2 -3.35,5.75
SOT96P240X100-3N = smd 1.1 x 0.65: 1 -1.05,0.96; 2 -1.05,-0.96; 3 1.05,0
R0402 = smd 0.7 x 0.9: 1 -0.65,0; 2 0.65,0
435171014816 = smd 0.65 x 0.6: 1 -1.575,0.85; 2 1.575,0.85; 3 -1.575,-0.85; 4 1.575,-0.85 | smd 0.35 x 0.7: 5 -1.725,0; 6 1.725,0
SJ = smd 1.168 x 1.6: 1 -0.762,0; 2 0.762,0
SW_MLL1200S = smd 0.7 x 1.1: 1 -2.25,2.05; 2 0.75,2.05; 3 2.25,2.05 | smd 1 x 0.8: G1 -3.75,1.15; G2 3.75,1.15; G3 -3.75,-1.15; G4 3.75,-1.15 | hole 0.9: -1.5,0; 1.5,0
SW_B3U-1000P = smd 0.8 x 1.7: 1 -1.7,0; 2 1.7,0
B2,54 = smd 2.54 x 2.54: TP 0,0
SOT95P285X140-5N = smd 1.35 x 0.6: 1 -1.185,0.95; 2 -1.185,0; 3 -1.185,-0.95; 4 1.185,-0.95; 5 1.185,0.95
XCVR_NINA-B306-00B = smd 1.15 x 0.7: 1 -4.125,5.7; 2 -4.125,4.7; 3 -4.125,3.7; 4 -4.125,2.7; 5 -4.125,1.7; 6 -4.125,0.7; 7 -4.125,-0.3; 8 -4.125,-1.3; 9 -4.125,-2.3; 10 -4.125,-3.3; 16 4.125,-3.3; 17 4.125,-2.3; 18 4.125,-1.3; 19 4.125,-0.3; 20 4.125,0.7; 21 4.125,1.7; 22 4.125,2.7; 23 4.125,3.7; 24 4.125,4.7; 25 4.125,5.7 | smd 0.7 x 1.15: 11 -2,-3.225; 12 -1,-3.225; 13 0,-3.225; 14 1,-3.225; 15 2,-3.225; 26 2,5.625; 27 1,5.625; 28 0,5.625; 29 -1,5.625; 30 -2,5.625 | smd 0.7 x 0.7: 31 -2.75,4.25; 32 -2.75,3.15; 33 -2.75,2.05; 34 -2.75,0.95; 35 -2.75,-0.15; 36 -2.75,-1.25; 37 2.75,-1.25; 38 2.75,-0.15; 39 2.75,0.95; 40 2.75,2.05; 41 2.75,3.15; 42 2.75,4.25; 43 1.65,4.25; 44 0.55,4.25; 45 -0.55,4.25; 46 -1.65,4.25; 47 4,6.85; 48 3,6.85; 49 2,6.85; 50 1,6.85; 51 0,6.85; 52 -1,6.85; 53 -2,6.85; 54 -3,6.85; 55 -4,6.85; EAGP1 -4.35,-4.3; EAGP2 4.35,-4.3; EAGP3 -4.35,-6.85; EAGP4 4.35,-6.85; EGP1 -0.575,2.925; EGP2 0.575,2.925; EGP3 -1.725,1.775; EGP4 -0.575,1.775; EGP5 0.575,1.775; EGP6 1.725,1.775; EGP7 -0.575,0.625; EGP8 0.575,0.625; EGP9 -1.725,-0.525; EGP10 -0.575,-0.525; EGP11 0.575,-0.525; EGP12 1.725,-0.525
LED_WS2812-2020 = smd 0.7 x 0.7: 1 -0.915,0.55; 2 -0.915,-0.55; 3 0.915,-0.55; 4 0.915,0.55
SHT40AD1FR2 = smd 0.5 x 0.3: 1 -0.7,0.4; 2 -0.7,-0.4; 3 0.7,-0.4; 4 0.7,0.4
APDS-9960 = smd 0.6 x 0.72: 1 0.7,1.455; 2 0.7,0.485; 3 0.7,-0.485; 4 0.7,-1.455; 5 -0.7,-1.455; 6 -0.7,-0.485; 7 -0.7,0.485; 8 -0.7,1.455
PAD_05_03X2_TP_NO4 = smd 1.27 x 1.27: 1 -2.54,-1.27; 2 -2.54,1.27; 3 0,-1.27; 5 2.54,-1.27; 6 2.54,1.27
SOT95P280X145-5N = smd 1.27 x 0.559: 1 -1.295,0.94; 2 -1.295,0; 3 -1.295,-0.94; 4 1.295,-0.94; 5 1.295,0.94
MICROBUILDER_USB_C_CUSB31-CFM2AX-01-X = smd 0.575 x 1.15: A1B12 -3.2,3.545; A4B9 -2.4,3.545; B1A12 3.2,3.545; B4A9 2.4,3.545 | smd 0.275 x 1.15: A5 -1.25,3.545; A6 -0.25,3.545; A7 0.25,3.545; A8 1.25,3.545; B5 1.75,3.545; B6 0.75,3.545; B7 -0.75,3.545; B8 -1.75,3.545 | drill 0.6 pad 1 long: M1 -4.32,2.97; M2 4.32,2.97; M3 -4.32,-1.21; M4 4.32,-1.21 | hole 0.65: 2.89,2.47; -2.89,2.47

### Placement (x,y rotation side)
C1  13.82,15.6 0 top
C2  26.95,33.77 0 top
C3  27.83,39.45 0 top
C4  10.57,30.73 270 top
C8  25.65,32.5 180 top
C9  26.98,31.17 0 top
C10  25.67,29.9 180 top
C17  37.38,33.23 0 top
D1  30.2,37.67 90 top
IC1  25,25 0 top
J1  43,34 270 top
J2  7,34 0 top
J3  43,16 270 top
J5  7,16 0 top
J6  14.6,26.3 270 top
LED1  23.52,18.55 180 top
LED3  37.33,27.75 180 top
MK2  37.48,19.32 90 top
P1  26.73,34.92 270 bottom
Q1  33.52,41.75 90 top
R1  25.27,40.17 180 top
R2  32,45.38 270 top
R3  11.52,15 90 top
R4  16.93,8.68 90 top
R5  22.17,41.33 0 top
R6  28.15,41.25 180 top
R7  19.65,20.1 0 top
R8  19.7,18.15 0 top
R9  27.4,18.15 180 top
R10  33.05,27.65 270 top
R11  35.73,27.65 90 top
R12  32.8,6.95 0 top
R13  32.8,8.95 0 top
R14  30.9,28.85 90 top
R16  8.35,28.48 0 top
S1  40,25 270 top
S2  10,25 270 top
SJ1  30.9,25.73 90 top
SW1  47.83,25 90 top
SW2  13.23,19 180 top
TP1  31.4,21.15 0 top
U1  25.27,36.75 270 top
U2  25,8.25 0 top
U3  33.17,14.57 180 top
U4  13.35,30.73 180 top
U5  20,33.92 90 top
U$2  4,25 270 top
U$3  34.3,30.67 180 top
X4  25,47 180 top

### Tracks (layer width: path | path; a pad name or v marks a point on that pad's centre or on a via)
CLICK  (via drill 0.1)
  Top 0.254: R16.2 9.65,28.48 arc-45 10.68,28.05 arc-45 10.85,27.63 S2.1 arc-45 11.27,27.6 v11.57,27.9 | 40.95,26.82 arc-45 S1.1 40.85,26.8 arc45 40.55,27.52 arc45 40.07,27.73 v39.9,27.73
  Route3 0.254: v11.57,27.9 11.57,23.5 arc45 12.32,21.71 12.98,21.05 arc-45 13.7,19.3 13.7,14.03 arc45 14.44,12.23 18.93,7.74 arc45 20.73,7 U2.36 25.67,7 arc-45 27,6.45 arc45 28.03,6.02 30.55,6.02 arc45 31.58,6.45 34.61,9.48 arc45 35.35,11.28 35.35,13.35 arc-45 36.09,15.14 39.16,18.21 arc45 39.9,20 v39.9,27.73
  other vias: 22.25,7
D3  (via drill 0.1)
  other vias: 29.12,9.95
D7  (via drill 0.1)
  Top 0.254: U2.47 arc-45 29.06,15.12 U3.3
  other vias: 29,15.1
D8  (via drill 0.1)
  Top 0.254: U2.48 arc-45 28.39,16.04 28.62,16.27 arc-45 30.5,17.05 30.97,17.05 arc-45 32.9,16.25 arc-45 33.23,15.46 33.23,14.99 arc-45 32.95,14.32 32.93,14.3 arc-45 U3.4
  other vias: 28,15.1
D+  (via drill 0.1)
  Top 0.254: 24.25,43.15 X4.B6 24.25,42.77 arc45 24.35,42.52 24.62,42.26 arc-45 v24.73,42 arc-45 24.78,42.13 25.1,42.45 arc45 25.25,42.81 X4.A6
  Route2 0.254: v24.73,42 21.07,38.34 arc45 20.32,36.55 20.32,17.83 arc45 21.07,16.03 U2.54
  other vias: 22,15.1
D-  (via drill 0.1)
  Top 0.254: X4.A7 24.75,43.87 arc-45 24.95,44.35 arc-45 25.19,44.45 25.32,44.45 arc-45 25.62,44.33 arc-45 25.75,44.02 X4.B7 v25.75,42
  Route2 0.254: v25.75,42 arc45 25.56,42.47 25.4,42.62 arc45 24.92,42.83 24.75,42.83 arc45 24.15,42.58 20.22,38.64 arc45 19.48,36.85 19.48,17.68 arc45 20.22,15.88 U2.55
  other vias: 21,15.1
GND
  pour Top: 0.25,25 arc-90 25,49.75 arc-90 49.75,25 arc-90 25,0.25 arc-90
  pour Bottom: 0.25,25 arc-90 25,49.75 arc-90 49.75,25 arc-90 25,0.25 arc-90
LB  (via drill 0.1)
  Top 0.254: R7.1 v18.15,20.1
  Route14 0.254: U2.43 arc-45 25.24,13.08 18.28,20.05 arc45 v18.15,20.1
  other vias: 26.65,12.5
LG  (via drill 0.1)
  Top 0.1: U2.4 v20.82,10.95
  Top 0.254: U2.4 19.87,10.95 arc-45 18.73,11.43 18.22,11.93 arc-45 17.48,13.73 17.48,16.05 arc-45 18.22,17.84 18.27,17.9 arc-45 18.88,18.15 R8.1
LR  (via drill 0.1)
  Top 0.1: U2.5 v20.85,9.93
  Top 0.254: R9.1 arc-45 28,18.27 v28,19.12
  Route15 0.254: v20.85,9.93 27.26,16.33 arc45 28,18.13 v28,19.12
MIC_PWR  (via drill 0.1)
  Top 0.254: MK2.1 MK2.2 arc-45 36.42,19.91 36.02,20.3 arc45 35.54,20.5 v34.98,20.5
  Route14 0.203: U2.51 27.18,17.28 arc-45 28.98,18.02 30.42,18.02 arc45 33.97,19.49 v34.98,20.5
  other vias: 25,15.1
N$2
  Top 0.254: IC1.5 28.4,23.09 arc-45 30.2,22.35 TP1.TP
N$4
  Top 0.305: U$3.1 35.59,28.61 arc45 R11.2
N$7
  Top 0.254: X4.B5 23.25,42.35 arc-45 R5.2
N$9
  Top 0.254: X4.A5 26.25,42.05 arc45 26.39,41.71 arc45 R6.2
N$10
  Top 0.254: U1.1 arc-45 26.62,38.9 C3.1
  Top 0.305: R1.1 arc-45 26.26,39.36 26.26,37.95
  Top 0.508: Q1.2 34.48,39.11 arc-45 33.74,37.32 33.34,36.92 arc-45 31.55,36.17 D1.1 29.18,37.19 arc45 27.39,37.94 U1.1 arc-45 26.26,37.95
N$12
  Top 0.254: U5.3 U5.4
N$13
  Top 0.305: IC1.8 29.89,26.91 arc-45 SJ1.2 R14.1
N$15
  Top 0.254: IC1.3 16.37,24.37 arc45 J6.2
N$17
  Top 0.254: R7.2 20.92,20.1 arc-45 22.72,19.36 LED1.4
N$18
  Top 0.254: R8.2 LED1.3
N$26
  Top 0.305: U$3.5 33.01,28.41 arc45 R10.1
N$30
  Top 0.305: R11.1 LED3.C
N$32
  Top 0.254: R9.2 LED1.2
P0.18/RESET  (via drill 0.1)
  Top 0.1: U2.19 v29.17,7.95
  Top 0.127: U$2.6 v5.27,22.45
  Top 0.254: C1.1 12.52,15.6 arc-45 v12.4,15.65 R3.2 SW2.2
  Route15 0.254: v5.27,22.45 6.02,22.45 arc-45 7.82,21.71 11.66,17.87 arc-45 12.4,16.07 v12.4,15.65 arc45 12.77,14.75 20.53,6.99 arc45 22.33,6.25 25.57,6.25 arc45 27.37,6.99 27.83,7.45 arc-45 29.03,7.95 v29.17,7.95
PDMCLK  (via drill 0.1)
  Top 0.203: MK2.3 36.55,18.9 v34.45,16.8
  Route14 0.203: U2.42 28.45,12.5 arc45 31.35,13.7 v34.45,16.8
  other vias: 27.75,12.5
PDMDIN  (via drill 0.1)
  Top 0.254: MK2.4 arc-45 38.58,18.72 39.15,18.15 arc-45 39.58,17.12 v39.58,16.82
  Route2 0.254: v39.58,16.82 39.58,16.76 arc-45 39.36,16.23 35.27,12.14 arc-45 33.47,11.4 25.38,11.4 arc45 23.58,10.66 U2.7
  other vias: 20.88,7.95
PEN  (via drill 0.1)
  Top 0.254: U1.3 arc45 24.17,38 v23.25,38
  Top 0.305: R1.2 arc45 24.33,39.45 U1.3 | SW1.2 v44.75,25.75
  Route2 0.254: v23.25,38 34.76,26.49 arc45 36.55,25.75 v44.75,25.75
SCL  (via drill 0.1)
  Top 0.254: U2.18 R12.1 | IC1.7 arc-45 27.62,25.6 v26.05,25.6 | U4.2 v15.68,31.12 17.32,31.12 arc45 19.07,31.85 arc45 19.52,32.91 U5.7
  Route3 0.254: U2.18 arc45 30.28,7.43 31.5,8.65 arc45 32.12,10.16 32.12,22.48 arc45 31.38,24.27 30.6,25.05 arc45 29.27,25.6 v26.05,25.6 25.83,25.6 arc-45 24.03,26.34 19.99,30.38 arc45 18.2,31.12 v15.68,31.12
  other vias: 29.12,6.95
SDA  (via drill 0.1)
  Top 0.1: U2.20 v29.15,8.95
  Top 0.254: U2.20 R13.1 | IC1.6 26.07,24.37 arc45 v26.05,24.38 | U4.1 v15.68,30.33 | U5.1 v17.45,34.62
  Route3 0.254: v29.15,8.95 arc45 29.79,9.21 30.3,9.73 arc45 30.67,10.63 30.67,21 arc45 29.93,22.79 29,23.73 arc45 27.43,24.38 v26.05,24.38 25.4,24.38 arc-45 23.61,25.12 19.14,29.58 arc45 17.35,30.33 v15.68,30.33 arc-45 14.99,30.61 14.92,30.68 arc-45 14.48,31.75 14.48,32.2 arc-45 15.22,33.99 15.27,34.05 arc-45 16.66,34.62 v17.45,34.62
SWDCLK  (via drill 0.1)
  Top 0.127: U$2.3 v2.75,25
  Top 0.254: R4.2 arc45 16.8,9.38 v15.93,9.38
  Route14 0.254: U2.11 22.42,5.61 arc45 20.62,6.35 19.9,6.35 arc-45 18.28,7.02 v15.93,9.38 10.52,14.78 arc-45 9.77,16.58 9.77,19.7 arc45 9.03,21.49 6.27,24.26 arc45 4.47,25 v2.75,25
  other vias: 23,5.02
SWDIO  (via drill 0.1)
  Top 0.127: U$2.2 v5.29,27.54 v5.3,27.55
  Route14 0.254: U2.15 23.77,8.26 arc45 21.97,9 20.98,9 arc-45 19.18,9.74 16.02,12.91 arc-45 15.27,14.7 15.27,16.62 arc45 14.53,18.42 5.47,27.48 arc45 v5.3,27.55
  other vias: 27,5.02
VBAT  (via drill 0.1)
  Top 0.508: Q1.3 v33.52,44.02 | C17.1 36.67,33.17 v35.8,33.17 arc45 35.59,32.68 U$3.3
  Route15 0.508: v33.52,44.02 33.52,40.4 arc-45 32.78,38.61 30.84,36.67 arc-45 29.05,35.92 v23.05,35.92
  Bottom 0.508: v33.52,44.02 33.52,35.83 arc45 34.27,34.03 34.73,33.58 arc45 35.69,33.17 v35.8,33.17 | P1.2 v23.05,35.92
VBUS  (via drill 0.1)
  Top 0.305: LED3.A 37.33,29.1 arc-45 37.3,29.07 v37.3,29.55
  Top 0.406: Q1.1 32.56,43.36 arc45 R2.2
  Top 0.508: X4.B4A9 v22.6,42.4 | X4.A4B9 v27.4,42.45 | D1.2 v30.2,40.7 Q1.1 | v31.77,31.62 32.98,31.62 arc-45 U$3.4
  Bottom 0.305: U2.31 22.5,12.5 arc45 24.29,13.24 31.03,19.98 arc45 31.77,21.78 v31.77,31.62 33.11,30.29 arc45 34.9,29.55 v37.3,29.55
  Bottom 0.508: v22.6,42.4 22.68,42.48 arc-45 24.48,43.23 25.57,43.23 arc-45 27.37,42.48 v27.4,42.45 28.41,41.44 arc45 v30.2,40.7 30.2,34.3 arc45 30.98,32.42 v31.77,31.62
  other vias: 22.25,12.5
VCC  (via drill 0.1)
  Top 0.127: U$2.1 v2.72,27.55
  Top 0.254: U2.9 20.05,5.95 arc-45 18.26,6.69 R4.1 | R13.2 R12.2 33.45,6.12 arc45 v33.33,6 | IC1.2 23,25.63 arc-45 23.75,25.33 arc-45 23.92,24.9 LED1.1 | R3.1 12.23,14.35 arc-45 v12.35,14.3 | U$2.1 3.28,28.09 | 3.28,28.09 5.82,30.63 arc-45 7.62,31.38 C4.1 arc45 11.18,31.12 U4.3 | U5.8 arc-45 18.77,33.77 18.77,33.77 arc-45 19.14,33.92 20.91,33.92 arc-45 21.27,33.77 arc-45 21.45,33.34 U5.5 arc-45 22.78,33.77 C2.1 | 3.28,28.09 arc-45 5.05,28.83 6.86,28.83 arc-45 R16.1
  Top 0.305: v27.05,29.9 arc45 28.02,29.5 R14.2
  Top 0.406: U2.9 U2.10 | v27.05,29.9 arc-45 26.48,28.53 25.6,27.65 arc-45 23.8,26.91 IC1.1 IC1.2
  Top 0.508: U1.5 arc-45 26.3,35.38 C2.1 C8.1 arc-45 26.33,32.44 C9.1 C10.1 v27.05,29.9
  Bottom 0.254: U2.10 21.08,5.16 arc-45 22.88,5.9 33.08,5.9 arc45 v33.33,6 | 16.7,20.73 14.62,18.64 arc45 13.88,16.85 13.88,16.52 arc-45 13.38,15.33 v12.35,14.3 | 9.55,20.73 arc-45 8.23,21.27 3.27,26.23 arc-45 v2.72,27.55
  Bottom 0.305: 22.48,20.73 16.7,20.73 9.55,20.73
  Bottom 0.406: v27.05,29.9 28.52,28.43 arc-45 29.2,26.79 29.2,21.73 arc-45 28.93,21.07 arc-45 28.1,20.73 22.48,20.73 21.85,20.73 arc45 20.69,20.24 arc45 19.45,17.25 19.45,7.43 arc45 20.19,5.63 U2.10
  other vias: 20.88,4.95

### Text on the board
Bottom: Sponde v2.0 / by Tanmoy
bNames: Sponde v2.0